# EasyEDA Pro project EMG_frontend.eprj, schematic EMG_channel_final_1
Board Name: EMG_channel_final; Create Date: 2025-03-20; Page Name: P1; Project Name: EMG_frontend; Schematic Name: EMG_channel_final_1; Update Date: 2025-03-21; Company: EasyEDA.com; Page Size: A4; Version: V1.0
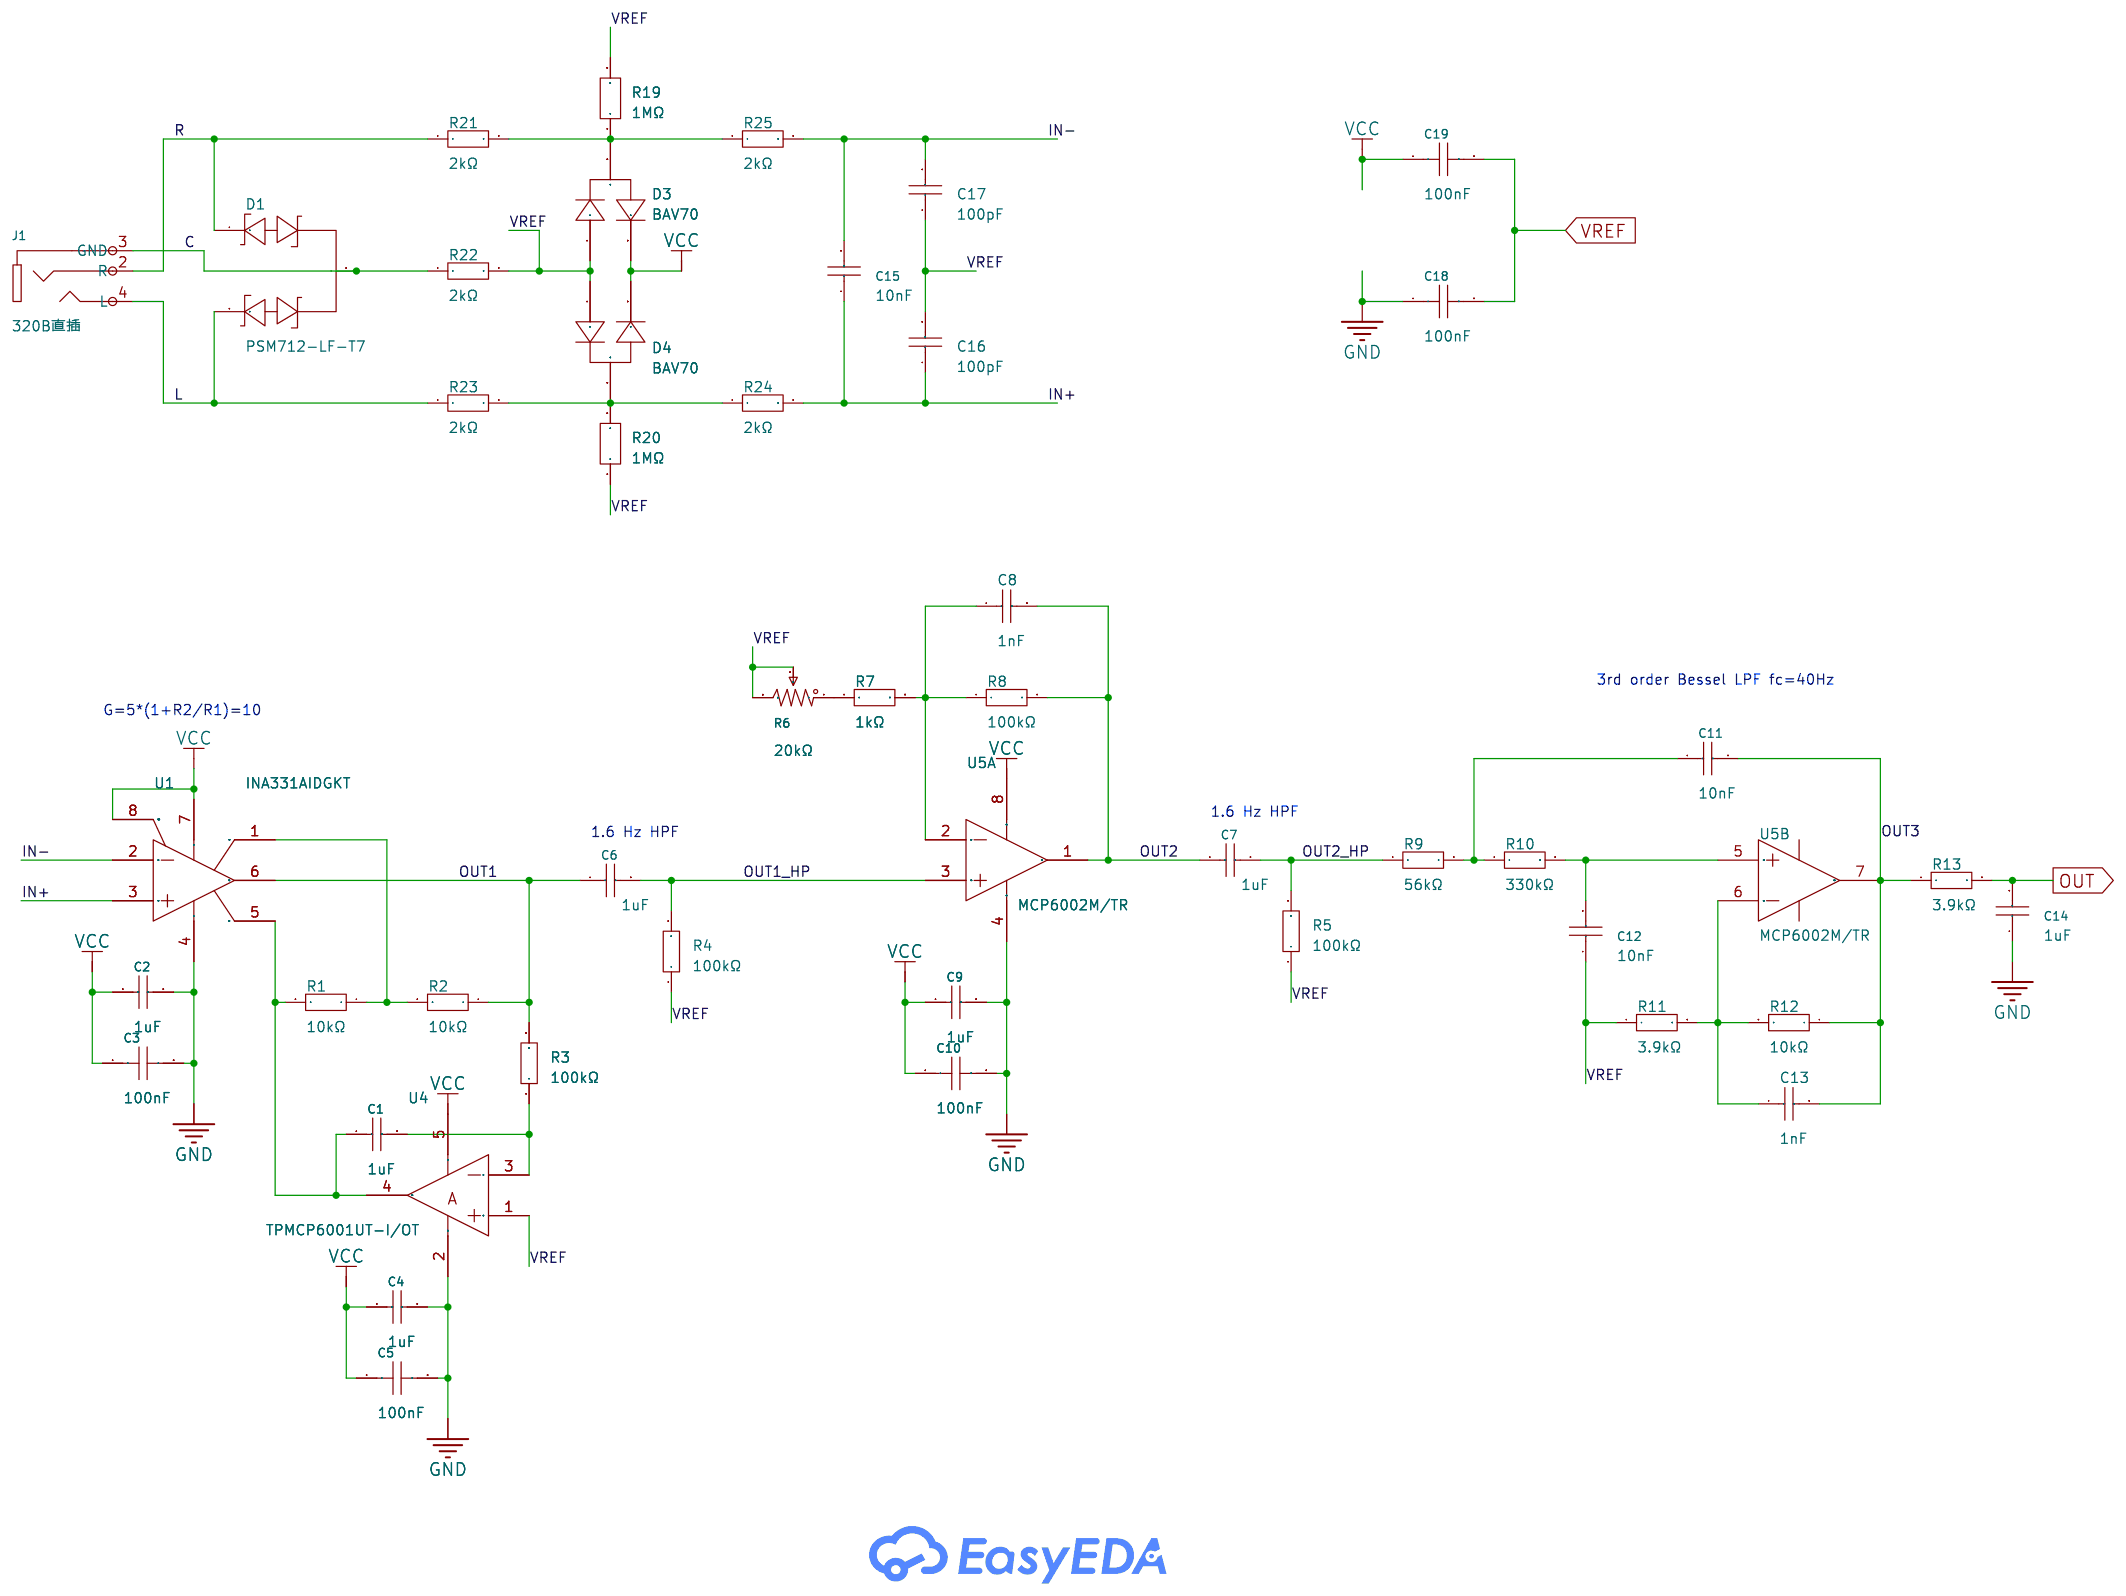
[diagram p0: schematic sheet]

## Parts
C1  1uF  [C0402]
C2  1uF  [C0402]
C3  100nF  [C0402]
C4  1uF  [C0402]
C5  100nF  [C0402]
C6  1uF  [C0402]
C7  1uF  [C0402]
C8  1nF  [C0402]
C9  1uF  [C0402]
C10  100nF  [C0402]
C11  10nF  [C0402]
C12  10nF  [C0402]
C13  1nF  [C0402]
C14  1uF  [C0402]
C15  10nF  [C0402]
C16  100pF  [C0402]
C17  100pF  [C0402]
C18  100nF  [C0402]
C19  100nF  [C0402]
D1  PSM712-LF-T7  [SOT-23-3_L3.0-W1.7-P0.95-LS2.9-BR]
D3  BAV70  [SOT-23-3_L3.0-W1.7-P0.95-LS2.9-BR]
D4  BAV70  [SOT-23-3_L3.0-W1.7-P0.95-LS2.9-BR]
J1  320B直插  [AUDIO-TH_PJ-3200]
R1  10kΩ  [R0402]
R2  10kΩ  [R0402]
R3  100kΩ  [R0402]
R4  100kΩ  [R0402]
R5  100kΩ  [R0402]
R6  20kΩ  [RES-ADJ-TH_3P-L9.5-W4.85-P2.54_PV36W103C01B00]
R7  1kΩ  [R0402]
R8  100kΩ  [R0402]
R9  56kΩ  [R0603]
R10  330kΩ  [R0603]
R11  3.9kΩ  [R0603]
R12  10kΩ  [R0402]
R13  3.9kΩ  [R0603]
R19  1MΩ  [R0402]
R20  1MΩ  [R0402]
R21  2kΩ  [R0402]
R22  2kΩ  [R0402]
R23  2kΩ  [R0402]
R24  2kΩ  [R0402]
R25  2kΩ  [R0402]
U1  INA331AIDGKT  [VSSOP-8_L3.0-W3.0-P0.65-LS4.9-BL]
U4  TPMCP6001UT-I/OT  [SOT-23-5_L2.9-W1.6-P0.95-LS2.8-BR]
U5  MCP6002M/TR  [SOP-8_L4.9-W3.9-P1.27-LS6.0-BL]  (sections 1,2)

## Library data of the parts
C1 C2 C4 C6 C7 C9 C14 = CL05A105KA5NQNC: Capacitance: Tolerance:±10% Tolerance:±10% Voltage Rated: Temperature Coefficient:; LCSC Part Name: 1uF ±10% 25V; Supplier Part: C52923; Manufacturer: SAMSUNG(三星); Supplier Footprint: 0402; JLCPCB Part Class: Basic Part; Datasheet: https://atta.szlcsc.com/upload/public/pdf/source/20160218/1457707763339.pdf; Supplier: LCSC; Tolerance: ±10%
C3 C5 C10 C18 C19 = CL05B104KO5NNNC: Capacitance: Tolerance:±10% Tolerance:±10% Voltage Rated: Temperature Coefficient:; LCSC Part Name: 100nF ±10% 16V; Supplier Part: C1525; Manufacturer: SAMSUNG(三星); Supplier Footprint: 0402; JLCPCB Part Class: Basic Part; Datasheet: https://atta.szlcsc.com/upload/public/pdf/source/20160218/1457707763339.pdf; Supplier: LCSC; Tolerance: ±10%
C8 C13 = 0402B102K500NT: Capacitance:1nF Tolerance:±10% Tolerance:±10% Voltage Rated: Temperature Coefficient:; LCSC Part Name: 1nF ±10% 50V; Supplier Part: C1523; Manufacturer: FH(风华); Supplier Footprint: 0402; JLCPCB Part Class: Basic Part; Datasheet: https://atta.szlcsc.com/upload/public/pdf/source/20200305/C486355_26A10D38EF8C2A5C37091D0039909270.pdf; Supplier: LCSC; Tolerance: ±10%
C11 C12 C15 = CL05B103KB5NNNC: Capacitance: Tolerance:±10% Tolerance:±10% Voltage Rated: Temperature Coefficient:; LCSC Part Name: 10nF ±10% 50V; Supplier Part: C15195; Manufacturer: SAMSUNG(三星); Supplier Footprint: 0402; JLCPCB Part Class: Basic Part; Datasheet: https://atta.szlcsc.com/upload/public/pdf/source/20160218/1457707763339.pdf; Supplier: LCSC; Tolerance: ±10%
C16 C17 = 0402CG101J500NT: Capacitance: Tolerance:±5% Tolerance:±5% Voltage Rated: Temperature Coefficient:; LCSC Part Name: 100pF ±5% 50V; Supplier Part: C1546; Manufacturer: FH(风华); Supplier Footprint: 0402; JLCPCB Part Class: Basic Part; Datasheet: https://atta.szlcsc.com/upload/public/pdf/source/20200305/C486355_26A10D38EF8C2A5C37091D0039909270.pdf; Supplier: LCSC; Tolerance: ±5%
D1 = PSM712-LF-T7_C32677: Reverse Stand-Off Voltage (Vrwm):12V Clamping Voltage:19V Voltage - Breakdown:13.3V Type:TVS; Supplier Part: C32677; Manufacturer: PROTEK; Supplier Footprint: SOT-23; JLCPCB Part Class: Basic Part; Datasheet: https://atta.szlcsc.com/upload/public/pdf/source/20140717/1457707154667.pdf; Supplier: LCSC; Reverse Stand-Off Voltage (Vrwm): 12V; Clamping Voltage: 19V; Voltage - Breakdown: 13.3V; Type: TVS
D3 D4 = BAV70_C68978: Diode Configuration:1 pair of common cathodes Voltage - Forward(Vf@If):1.25V@150mA Voltage - DC Reverse(Vr):70V Current - Rectified:200mA Reverse Leakage Current (Ir):2.5uA@70V Reverse Recovery Time (trr):- Operating Temperature:- Operating Temperature:-; Supplier Part: C68978; Manufacturer: CJ(江苏长电/长晶); Supplier Footprint: SOT-23; JLCPCB Part Class: Basic Part; Datasheet: https://atta.szlcsc.com/upload/public/pdf/source/20160516/1463363920256.pdf; Supplier: LCSC; Diode Configuration: 1 pair of common cathodes; Voltage - Forward(Vf@If): 1.25V@150mA; Voltage - DC Reverse(Vr): 70V; Current - Rectified: 200mA; Reverse Leakage Current (Ir): 2.5uA@70V
J1 = 320B直插: Connector Type:- Current Rating (Max):- Voltage Rating (Max):-; LCSC Part Name: 320B直插 黑色; Supplier Part: C18166; Manufacturer: BOOMELE(博穆精密); Supplier Footprint: 插件; JLCPCB Part Class: Extended Part; Supplier: LCSC
R1 R2 R12 = 0402WGF1002TCE: Type:Thick Film Resistors Resistance:10kΩ Tolerance:±1% Tolerance:±1% Power(Watts): Overload Voltage (Max): Temperature Coefficient:±100ppm/℃ Temperature Coefficient:±100ppm/℃ Operating Temperature Range:-55℃~+155℃ Operating Temperature Range:-55℃~+155℃; LCSC Part Name: 10kΩ ±1% 62.5mW 厚膜电阻; Supplier Part: C25744; Manufacturer: UNI-ROYAL(厚声); Supplier Footprint: 0402; JLCPCB Part Class: Basic Part; Datasheet: https://atta.szlcsc.com/upload/public/pdf/source/20200306/C422600_1E6D84923E4A46A82E41ADD87F860B5C.pdf; Supplier: LCSC; Type: Thick Film Resistors; Tolerance: ±1%; Temperature Coefficient: ±100ppm/℃; Operating Temperature Range: -55℃~+155℃
R3-R5 R8 = 0402WGF1003TCE: Type:Thick Film Resistors Resistance:100kΩ Tolerance:±1% Tolerance:±1% Power(Watts): Overload Voltage (Max): Temperature Coefficient:±100ppm/℃ Temperature Coefficient:±100ppm/℃ Operating Temperature Range:-55℃~+155℃ Operating Temperature Range:-55℃~+155℃; LCSC Part Name: 100kΩ ±1% 62.5mW 厚膜电阻; Supplier Part: C25741; Manufacturer: UNI-ROYAL(厚声); Supplier Footprint: 0402; JLCPCB Part Class: Basic Part; Datasheet: https://atta.szlcsc.com/upload/public/pdf/source/20200306/C422600_1E6D84923E4A46A82E41ADD87F860B5C.pdf; Supplier: LCSC; Type: Thick Film Resistors; Tolerance: ±1%; Temperature Coefficient: ±100ppm/℃; Operating Temperature Range: -55℃~+155℃
R6 = PV36W203C01B00: Resistance: Tolerance:±10% Tolerance:±10% Power(Watts): Temperature Coefficient:±100ppm/℃ Temperature Coefficient:±100ppm/℃ Turns:; LCSC Part Name: 20kΩ ±10%; Supplier Part: C6738784; Manufacturer: BOURNS; Supplier Footprint: SIP-3P,9.6x5mm; JLCPCB Part Class: Extended Part; Datasheet: https://atta.szlcsc.com/upload/public/pdf/source/20230714/B0C7AFE1CE7338BB4B64B9397CDD00E0.pdf; Supplier: LCSC; Tolerance: ±10%; Temperature Coefficient: ±100ppm/℃
R7 = 0402WGF1001TCE: Type:Thick Film Resistors Resistance:1kΩ Tolerance:±1% Tolerance:±1% Power(Watts): Overload Voltage (Max): Temperature Coefficient:±100ppm/℃ Temperature Coefficient:±100ppm/℃ Operating Temperature Range:-55℃~+155℃ Operating Temperature Range:-55℃~+155℃; LCSC Part Name: 1kΩ ±1% 62.5mW 厚膜电阻; Supplier Part: C11702; Manufacturer: UNI-ROYAL(厚声); Supplier Footprint: 0402; JLCPCB Part Class: Basic Part; Datasheet: https://atta.szlcsc.com/upload/public/pdf/source/20200306/C422600_1E6D84923E4A46A82E41ADD87F860B5C.pdf; Supplier: LCSC; Type: Thick Film Resistors; Tolerance: ±1%; Temperature Coefficient: ±100ppm/℃; Operating Temperature Range: -55℃~+155℃
R9 = 0603WAF5602T5E: Type:Thick Film Resistors Resistance:56kΩ Tolerance:±1% Tolerance:±1% Power(Watts): Overload Voltage (Max): Temperature Coefficient:±100ppm/℃ Temperature Coefficient:±100ppm/℃ Operating Temperature Range:-55℃~+155℃ Operating Temperature Range:-55℃~+155℃; LCSC Part Name: 56kΩ ±1% 100mW 厚膜电阻; Supplier Part: C23206; Manufacturer: UNI-ROYAL(厚声); Supplier Footprint: 0603; JLCPCB Part Class: Basic Part; Datasheet: https://atta.szlcsc.com/upload/public/pdf/source/20200306/C422600_1E6D84923E4A46A82E41ADD87F860B5C.pdf; Supplier: LCSC; Type: Thick Film Resistors; Tolerance: ±1%; Temperature Coefficient: ±100ppm/℃; Operating Temperature Range: -55℃~+155℃
R10 = 0603WAF3303T5E: Type:Thick Film Resistors Resistance:330kΩ Tolerance:±1% Tolerance:±1% Power(Watts): Overload Voltage (Max): Temperature Coefficient:±100ppm/℃ Temperature Coefficient:±100ppm/℃ Operating Temperature Range:-55℃~+155℃ Operating Temperature Range:-55℃~+155℃; LCSC Part Name: 330kΩ ±1% 100mW 厚膜电阻; Supplier Part: C23137; Manufacturer: UNI-ROYAL(厚声); Supplier Footprint: 0603; JLCPCB Part Class: Basic Part; Datasheet: https://atta.szlcsc.com/upload/public/pdf/source/20200306/C422600_1E6D84923E4A46A82E41ADD87F860B5C.pdf; Supplier: LCSC; Type: Thick Film Resistors; Tolerance: ±1%; Temperature Coefficient: ±100ppm/℃; Operating Temperature Range: -55℃~+155℃
R11 R13 = 0603WAF3901T5E: Type:Thick Film Resistors Resistance:3.9kΩ Tolerance:±1% Tolerance:±1% Power(Watts): Overload Voltage (Max): Temperature Coefficient:±100ppm/℃ Temperature Coefficient:±100ppm/℃ Operating Temperature Range:-55℃~+155℃ Operating Temperature Range:-55℃~+155℃; LCSC Part Name: 3.9kΩ ±1% 100mW 厚膜电阻; Supplier Part: C23018; Manufacturer: UNI-ROYAL(厚声); Supplier Footprint: 0603; JLCPCB Part Class: Basic Part; Datasheet: https://atta.szlcsc.com/upload/public/pdf/source/20200306/C422600_1E6D84923E4A46A82E41ADD87F860B5C.pdf; Supplier: LCSC; Type: Thick Film Resistors; Tolerance: ±1%; Temperature Coefficient: ±100ppm/℃; Operating Temperature Range: -55℃~+155℃
R19 R20 = 0402WGF1004TCE: Type:Thick Film Resistors Resistance:1MΩ Tolerance:±1% Tolerance:±1% Power(Watts): Overload Voltage (Max): Temperature Coefficient:±100ppm/℃ Temperature Coefficient:±100ppm/℃ Operating Temperature Range:-55℃~+155℃ Operating Temperature Range:-55℃~+155℃; LCSC Part Name: 1MΩ ±1% 62.5mW 厚膜电阻; Supplier Part: C26083; Manufacturer: UNI-ROYAL(厚声); Supplier Footprint: 0402; JLCPCB Part Class: Basic Part; Datasheet: https://atta.szlcsc.com/upload/public/pdf/source/20200306/C422600_1E6D84923E4A46A82E41ADD87F860B5C.pdf; Supplier: LCSC; Type: Thick Film Resistors; Tolerance: ±1%; Temperature Coefficient: ±100ppm/℃; Operating Temperature Range: -55℃~+155℃
R21-R25 = 0402WGF2001TCE: Type:Thick Film Resistors Resistance:2kΩ Tolerance:±1% Tolerance:±1% Power(Watts): Overload Voltage (Max): Temperature Coefficient:±100ppm/℃ Temperature Coefficient:±100ppm/℃ Operating Temperature Range:-55℃~+155℃ Operating Temperature Range:-55℃~+155℃; LCSC Part Name: 2kΩ ±1% 62.5mW 厚膜电阻; Supplier Part: C4109; Manufacturer: UNI-ROYAL(厚声); Supplier Footprint: 0402; JLCPCB Part Class: Basic Part; Datasheet: https://atta.szlcsc.com/upload/public/pdf/source/20200306/C422600_1E6D84923E4A46A82E41ADD87F860B5C.pdf; Supplier: LCSC; Type: Thick Film Resistors; Tolerance: ±1%; Temperature Coefficient: ±100ppm/℃; Operating Temperature Range: -55℃~+155℃
U1 = INA331AIDGKT: Number of Circuits:Single Channel Current - Input Bias(Ib):0.5pA Voltage - Input Offset(Vos):250uV Gain Bandwidth Product(GBP):- Slew Rate(SR):5V/us -3db Bandwidth:2MHz Rail to Rail:- Output Type:- Operating Temperature:-55℃~+125℃ Operating Temperature:-5; Supplier Part: C2057310; Manufacturer: TI(德州仪器); Supplier Footprint: MSOP-8; JLCPCB Part Class: Extended Part; Datasheet: https://www.ti.com/cn/lit/gpn/ina331; Supplier: LCSC; Number of Circuits: Single Channel; Current - Input Bias(Ib): 0.5pA; Voltage - Input Offset(Vos): 250uV; Slew Rate(SR): 5V/us; -3db Bandwidth: 2MHz; Operating Temperature: -55℃~+125℃
U4 = TPMCP6001UT-I/OT: Number of Channels:Single channel Maximum Power Supply Range (Vdd-Vss):5.5V Rail to Rail:rail-to-rail input,rail-to-rail output Gain Bandwidth Product:1MHz Vos - Input Offset Voltage:5mV Input Offset Voltage Drift(Vos TC):2uV/℃ Slew Rate:0.6V/us Noise den; Supplier Part: C2940623; Manufacturer: TECH PUBLIC(台舟); Supplier Footprint: SOT-23-5; JLCPCB Part Class: Extended Part; Datasheet: https://atta.szlcsc.com/upload/public/pdf/source/20220110/D6474F4998EFABE2A658B4E9F59770CE.pdf; Supplier: LCSC; Number of Channels: Single channel; Maximum Power Supply Range (Vdd-Vss): 5.5V; Rail to Rail: rail-to-rail input,rail-to-rail output; Gain Bandwidth Product: 1MHz; Vos - Input Offset Voltage: 5mV; Input Offset Voltage Drift(Vos TC): 2uV/℃; Slew Rate: 0.6V/us; Noise density(eN): 20nV/√Hz@10kHz; Common Mode Rejection Ratio(CMRR): 75dB; Operating Temperature: -40℃~+125℃
U5 = MCP6002M/TR: Number of Circuits:Dual Maximum Power Supply Range (Vdd-Vss):6V Rail to Rail:Rail-to-rail input, rail-to-rail output Gain Bandwidth Product(GBP):1MHz Voltage - Input Offset(Vos):3.5mV Input Offset Voltage Drift (Vos TC):2.7uV/℃ Slew Rate(SR):0.8V/us Noise; Supplier Part: C444396; Manufacturer: HGSEMI(华冠); Supplier Footprint: SOP-8; JLCPCB Part Class: Extended Part; Datasheet: https://atta.szlcsc.com/upload/public/pdf/source/20220914/46C1B43F2764661313E25FA6E1D64695.pdf; Supplier: LCSC; Number of Circuits: Dual; Maximum Power Supply Range (Vdd-Vss): 6V; Rail to Rail: Rail-to-rail input, rail-to-rail output; Gain Bandwidth Product(GBP): 1MHz; Voltage - Input Offset(Vos): 3.5mV; Input Offset Voltage Drift (Vos TC): 2.7uV/℃; Slew Rate(SR): 0.8V/us; Noise density(eN): 20nV/√Hz@10kHz; Common Mode Rejection Ratio (CMRR): 68dB; Operating Temperature: -40℃~+125℃

## Nets
GND: C2.2 C3.2 C4.2 C5.2 C9.2 C10.2 C14.1 C18.1 U1.4(V-) U4.2(-VS) U5.4(VSS)
VCC: C2.1 C3.1 C4.1 C5.1 C9.1 C10.1 C19.1 D3.2 D4.2 U1.7(V+) U1.8(Shutdown) U4.5(+VS) U5.8(VDD)
C: D1.3(K) J1.3(GND) R22.1
IN+: C15.1 C16.1 R24.2 U1.3(VIN+)
IN-: C15.2 C17.2 R25.2 U1.2(VIN-)
L: D1.2(A1) J1.4(L) R23.1
OUT: C14.2 R13.2
OUT1: C6.1 R2.1 R3.2 U1.6(VOUT)
OUT1_HP: C6.2 R4.2 U5.3(VINA+)
OUT2: C7.1 C8.2 R8.2 U5.1(VOUTA)
OUT2_HP: C7.2 R5.2 R9.1
OUT3: C11.2 C13.2 R12.1 R13.1 U5.7(VOUTB)
R: D1.1(A1) J1.2(R) R21.1
VREF: C12.1 C16.2 C17.1 C18.2 C19.2 D3.1 D4.1 R4.1 R5.1 R6.2 R6.3 R11.1 R19.2 R20.1 R22.2 U4.1(+IN)
$1N782: C1.2 R3.1 U4.3(-IN)
$1N800: C1.1 R1.2 U1.5(REF) U4.4(OUT)
$1N816: R1.1 R2.2 U1.1(RG)
$1N2150: R6.1 R7.1
$1N2207: C8.1 R7.2 R8.1 U5.2(VINA-)
$1N2765: C12.2 R10.2 U5.5(VINB+)
$1N2767: C11.1 R9.2 R10.1
$1N3046: C13.1 R11.2 R12.2 U5.6(VINB-)
$1N3779: D3.3 R19.1 R21.2 R25.1
$1N3785: D4.3 R20.2 R23.2 R24.1

## Notes on the sheet
- 3rd order Bessel LPF fc=40Hz
- G=5*(1+R2/R1)=10
- 1.6 Hz HPF
- 1.6 Hz HPF
